# Altium schematic sheet Main.SchDoc
size B
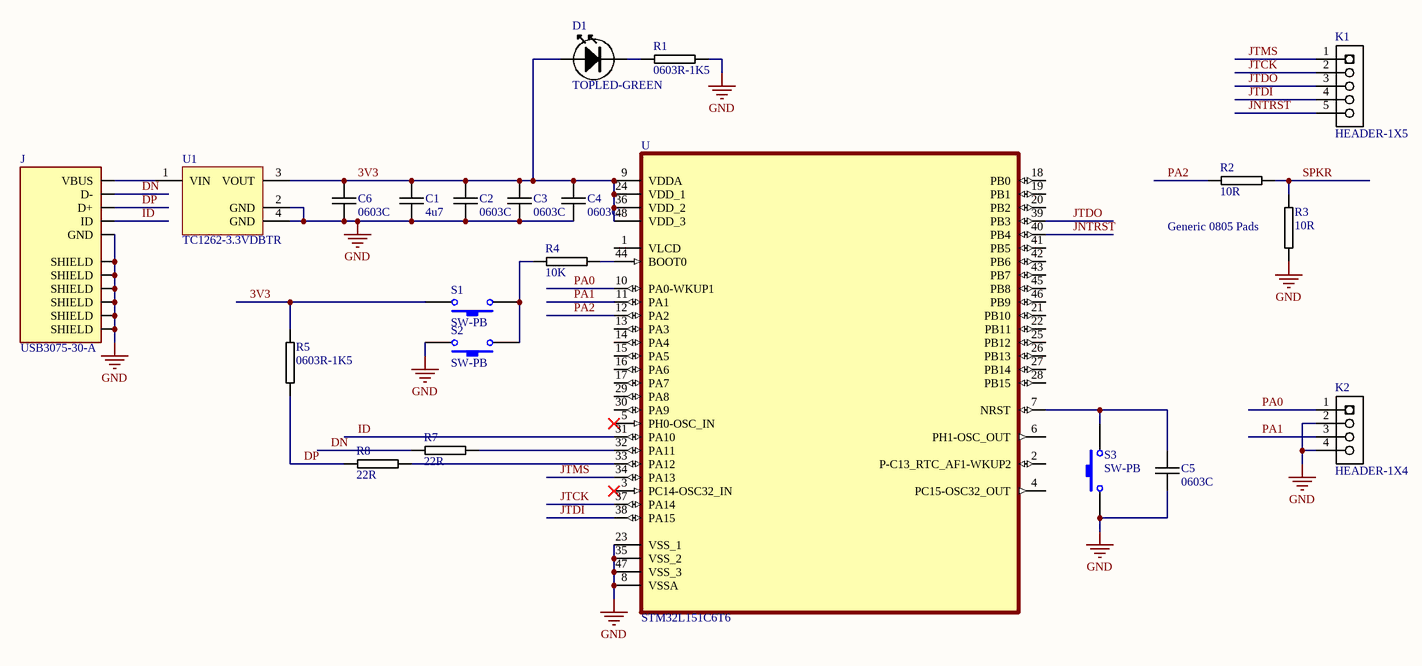
[diagram p0: Main.SchDoc]

## Parts
C1  4u7  [1210C-GENERIC]
C2  0603C  [0603C-GENERIC]
C3  0603C  [0603C-GENERIC]
C4  0603C  [0603C-GENERIC]
C5  0603C  [0603C-GENERIC]
C6  0603C  [0603C-GENERIC]
D1  TOPLED-GREEN  [TOPLED-GREEN]
J  USB3075-30-A  [GCT_USB3075-30-A]
K1  HEADER-1X5  [HEADER-1X5]
K2  HEADER-1X4  [HEADER-1X4]
R1  0603R-1K5  [0603R-1k5]
R2  10R  [0805R-10]
R3  10R  [0805R-10]
R4  10K  [0603R-10K]
R5  0603R-1K5  [0603R-1k5]
R7  22R  [0603R-22]
R8  22R  [0603R-22]
S1  SW-PB  [SPST-2]
S2  SW-PB  [SPST-2]
S3  SW-PB  [SPST-2]
U  STM32L151C6T6  [QFP50P900X900X160-48N]
U1  TC1262-3.3VDBTR  [SOT-223-DB3_N]

## Nets
GND: C1.2 C2.2 C3.2 C4.2 C5.2 C6.2 J.5(GND) J.S1(SHIELD) J.S2(SHIELD) J.S3(SHIELD) J.S4(SHIELD) J.S5(SHIELD) J.S6(SHIELD) K2.2 K2.4 R1.2 R3.1 S2.2 S3.1 U.8(VSSA) U.23(VSS_1) U.35(VSS_2) U.47(VSS_3) U1.2(GND) U1.4(GND)
3V3: C1.1 C2.1 C3.1 C4.1 C6.1 D1.A R5.1 S1.2 U.9(VDDA) U.24(VDD_1) U.36(VDD_2) U.48(VDD_3) U1.3(VOUT)
DN: J.2(D-) R7.1
DP: J.3(D+) R5.2 R8.1
ID: J.4(ID) U.31(PA10)
JNTRST: K1.5 U.40(PB4)
JTCK: K1.2 U.37(PA14)
JTDI: K1.4 U.38(PA15)
JTDO: K1.3 U.39(PB3)
JTMS: K1.1 U.34(PA13)
PA0: K2.1 U.10(PA0-WKUP1)
PA1: K2.3 U.11(PA1)
PA2: R2.1 U.12(PA2)
SPKR: R2.2 R3.2
NetC5_1: C5.1 S3.2 U.7(NRST)
NetD1_K: D1.K R1.1
NetJ_1: J.1(VBUS) U1.1(VIN)
NetR4_1: R4.1 S1.1 S2.1
NetR4_2: R4.2 U.44(BOOT0)
NetR7_2: R7.2 U.32(PA11)
NetR8_2: R8.2 U.33(PA12)

Not connected (* = marked no-connect by the designer): U 1(VLCD) 2(P-C13_RTC_AF1-WKUP2) 3(PC14-OSC32_IN)* 4(PC15-OSC32_OUT) 5(PH0-OSC_IN)* 6(PH1-OSC_OUT) 13(PA3) 14(PA4) 15(PA5) 16(PA6) 17(PA7) 18(PB0) 19(PB1) 20(PB2) 21(PB10) 22(PB11) 25(PB12) 26(PB13) 27(PB14) 28(PB15) 29(PA8) 30(PA9) 41(PB5) 42(PB6) 43(PB7) 45(PB8) 46(PB9)

## Notes on the sheet
- (near R3) Generic 0805 Pads
- Title
- Size:
- Date:
- B
- Number:
- Time:
- Revision:
- Sheet
- of
- File:

## Library data of the parts
C1 = 1210C-4U7-16V-X7R-TAY: GENERIC CAPACITOR NON POLARISED 1210; Manufacturer: Taiyo Yuden; Manufacturer Part Number: EMK325B7475KN-T; Reel: C38; Description: CAP CER 4.7UF 16V X7R 1210; Supplier 1: Digi-Key; Supplier Part Number 1: 587-1392-2-ND
C2-C6 = 0603C-GENERIC: CAPACITOR 0603 CERAMIC GENERIC
J = USB3075-30-A: USB - micro B USB 2.0 Receptacle Connector 5 Position Surface Mount, Right Angle; Through Hole; MF: Global Connector Technology; SnapEDA_Link: https://www.snapeda.com/parts/USB3075-30-A/Global%20Connector%20Technology/view-part/229370/?ref=snap; Value: *; Digi-Key_Part_Number: 2073-USB3075-30-ACT-ND; MP: USB3075-30-A; Digi-Key_Purchase_URL: https://www.digikey.com/product-detail/en/gct/USB3075-30-A/2073-USB3075-30-ACT-ND/9859705?utm_source=snapeda&utm_medium=aggregator&utm_campaign=symbol; Package: None
K1 = HEADER-1X5: PINHEADER 1X5; REEL: TH; Supplier 1: Digi-Key; Supplier Part Number 1: S1011E-36-ND
R1 R5 = 0603R-1K5: GENERIC RESISTOR 0603; Manufacturer Part Number: RMCF 1/16 15K 1% R; Manufacturer: Stackpole Electronics Inc; Tolerance: ±1%; Resistance In Ohms: 15.0K; Power (Watts): 0.1W, 1/10W; Temperature Coefficient: ±100ppm/°C; Description: RES 15K OHM 1/10W 1% 0603 SMD; Supplier 1: Digi-Key; Supplier Part Number 1: RMCF1/1615KFRTR-ND; Supplier: Digi-Key; Supplier Part Number: RMCF1/1615KFRTR-ND; Packaging: Tape & Reel (TR); Category: Resistors; Case: 0603 (1608 metric); Composition: Thick Film; Lead Style: Surface Mount (SMD - SMT); RoHS: RoHS Compliant
R2 R3 = 0805R-10: RESISTOR 0805 1/4 WATT THIN FILM; Reel: *
R4 = 0603R-10K: GENERIC RESISTOR 0603; Manufacturer: Stackpole Electronics Inc; Manufacturer Part Number: RMCF 1/16 10K 1% R; Tolerance: ±1%; Power (Watts): 0.1W, 1/10W; Temperature Coefficient: ±100ppm/°C; Description: RES 10K OHM 1/10W 1% 0603 SMD; Resistance In Ohms: 10.0K; Reel: R21; Category: Resistors; Supplier Part Number: RMCF1/1610KFRDKR-ND; Lead Style: Surface Mount (SMD - SMT); RoHS: RoHS Compliant; Packaging: Digi-Reel®; Case: 0603 (1608 metric); Composition: Thick Film; Supplier: Digi-Key; Supplier 1: Digi-Key; Supplier Part Number 1: RMCF0603FT10K0DKR-ND
R7 R8 = 0603R-22R: GENERIC RESISTOR 0603; Manufacturer Part Number: RMC 1/16 22 1% R; Manufacturer: Stackpole Electronics Inc; Tolerance: ±1%; Description: RES TF 1/10W 22 OHM 1% 0603; Power (Watts): 0.1W, 1/10W; Temperature Coefficient: ±100ppm/°C; Resistance In Ohms: 22.0; Supplier 1: Digi-Key; Supplier Part Number 1: RMC1/1622FR-ND; Supplier: Digi-Key; Case: 0603 (1608 metric); Supplier Part Number: RMC1/1622FR-ND; Category: Resistors; RoHS: RoHS Compliant; Composition: Thick Film; Packaging: Tape & Reel (TR); Lead Style: Surface Mount (SMD - SMT)
S1-S3 = SW-PB: Switch; Published: 24-Mar-1999; LatestRevisionDate: 17-Jul-2002; LatestRevisionNote: Re-released for DXP Platform.; PackageReference: SPST-2; Publisher: Altium Limited; PackageDescription: Switch; 2 Leads
U = STM32L151C6T6: ARM® Cortex®-M3 STM32L1 Microcontroller IC 32-Bit 32MHz 32KB _32K x 8_ FLASH 48-LQFP _7x7_; MF: STMicroelectronics; Availability: Unavailable; Package: LQFP-48 STMicroelectronics; SnapEDA_Link: https://www.snapeda.com/parts/STM32L151C6T6/STMicroelectronics/view-part/378994/?ref=snap; MP: STM32L151C6T6; Price: None; Value: *
U1 = TC1262-3.3VDBTR: 500mA Fixed Output CMOS LDO, 3-Pin SOT-223, Extended Temperature, Tape and Reel; Published: 29-Jan-2009; DatasheetVersion: revB, 2002; PackageVersion: revBB, Aug-2009; PackageReference: SOT-223-DB3; Publisher: Altium Limited; PackageDescription: 3-Lead Plastic Small Outline Transistor (DB) [SOT-223]; Supplier 1: Digi-Key; Supplier Part Number 1: TC1262-3.3VDBTR-ND; Supplier 2: Digi-Key; Supplier Part Number 2: TC1262-3.3VDBCT-ND; Supplier 3: Digi-Key; Supplier Part Number 3: TC1262-3.3VDBDKR-ND; Supplier 4: Farnell; Supplier Part Number 4: 1296594; ComponentLink1Description: Datasheet; ComponentLink1URL: http://ww1.microchip.com/downloads/en/DeviceDoc/21373b.pdf; ComponentLink2Description: Packaging Specification; ComponentLink2URL: http://www.microchip.com/stellent/groups/techpub_sg/documents/packagingspec/en012702.pdf; ComponentLink3Description: Microchip.com Home; ComponentLink3URL: http://www.microchip.com/
K2 = HEADER-1X4: Supplier 1: Digi-Key; Supplier Part Number 1: S1011E-36-ND